# EAGLE design satshakit-mega (EAGLE 8.4.3)

## Sheet 1 of 2
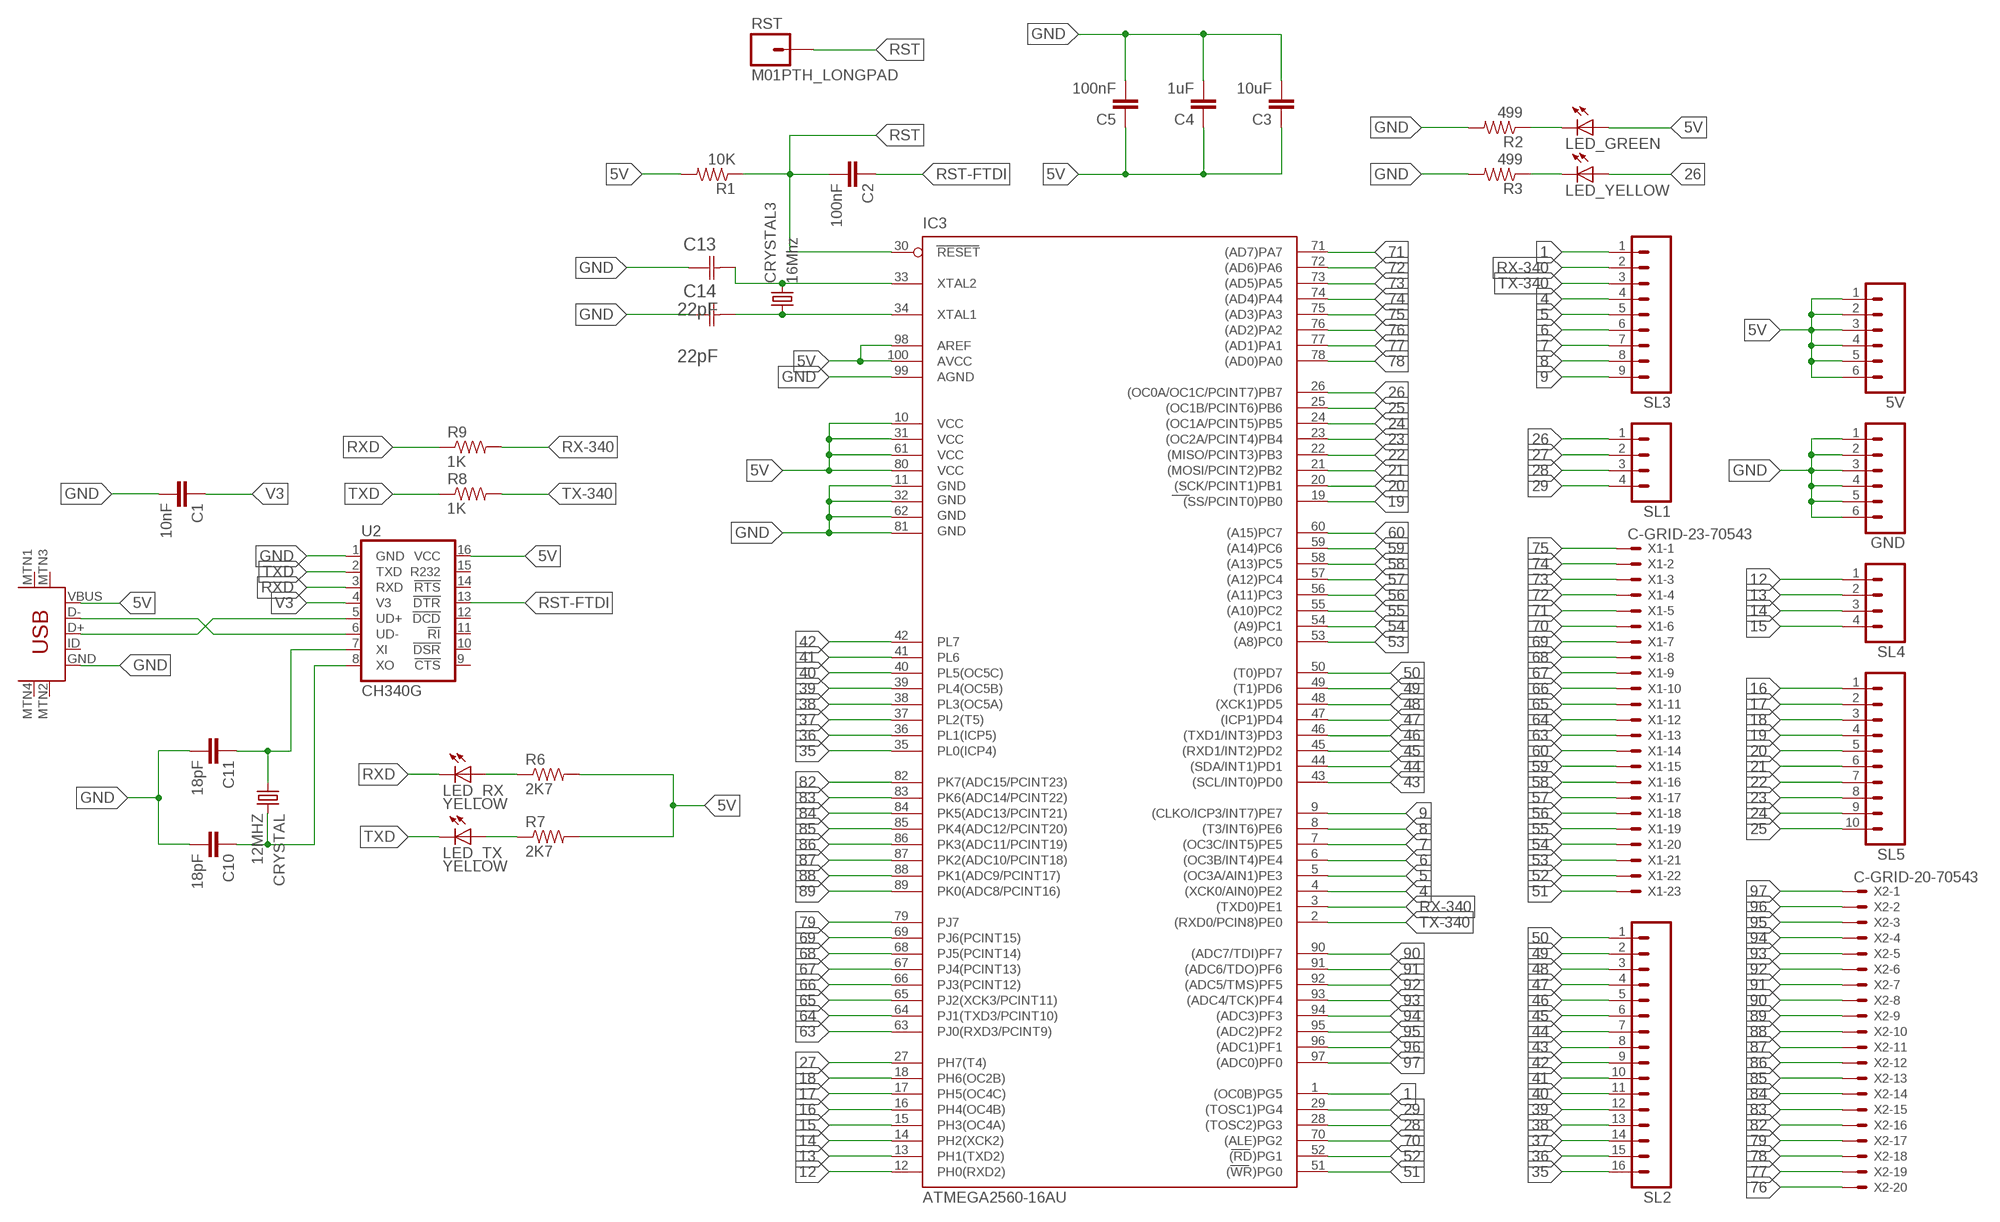
[diagram p0: schematic, sheet 1]

### Parts
5V  M06  [06P]
C1  10nF  CAP1206  [1206]
C2  100nF  CAP1206  [1206]
C3  10uF  CAP1206  [1206]
C4  1uF  CAP1206  [1206]
C5  100nF  CAP1206  [1206]
C10  18pF  CAP1206  [1206]
C11  18pF  CAP1206  [1206]
C13  22pF  0612ZC225MAT2A  [CAPC3216X178N]
C14  22pF  0612ZC225MAT2A  [CAPC3216X178N]
CRYSTAL  12MHZ  CSM-7X-DU  [CSM-7X-DU]
CRYSTAL3  16Mhz  CSM-7X-DU  [CSM-7X-DU]
GND  M06  [06P]
IC3  ATMEGA2560-16AU  ATMEGA1280-16AU  [TQFP100]
LED_GREEN  LED1206  [1206]
LED_RX  YELLOW  LED  [LED1206]
LED_TX  YELLOW  LED  [LED1206]
LED_YELLOW  LED1206  [1206]
R1  10K  RES-US1206  [R1206]
R2  499  RESISTOR1206  [1206]
R3  499  RESISTOR1206  [1206]
R6  2K7  RES-US1206  [R1206]
R7  2K7  RES-US1206  [R1206]
R8  1K  RES-US1206  [R1206]
R9  1K  RES-US1206  [R1206]
RST  M01PTH_LONGPAD  [1X01_LONGPAD]
SL1  M04  [04P]
SL2  M16  [16P]
SL3  M09  [09P]
SL4  M04  [04P]
SL5  M10  [10P]
U2  CH340G  CH340GSMD  [SO016]
U$7  USB-MINIB-5PIN  [USB-MINIB]
X1  C-GRID-23-70543  [70543-23]
X2  C-GRID-20-70543  [70543-20]

### Nets
1: IC3.1((OC0B)PG5) SL3.1
4: IC3.4((XCK0/AIN0)PE2) SL3.4
5: IC3.5((OC3A/AIN1)PE3) SL3.5
5V: 5V.1 5V.2 5V.3 5V.4 5V.5 5V.6 C3.1 C4.1 C5.1 IC3.10(VCC) IC3.31(VCC1) IC3.61(VCC2) IC3.80(VCC3) IC3.98(AREF) IC3.100(AVCC) LED_GREEN.1(A) R1.2 R6.2 R7.2 U2.16(VCC) U$7.VBUS
6: IC3.6((OC3B/INT4)PE4) SL3.6
7: IC3.7((OC3C/INT5)PE5) SL3.7
8: IC3.8((T3/INT6)PE6) SL3.8
9: IC3.9((CLKO/ICP3/INT7)PE7) SL3.9
12: IC3.12(PH0(RXD2)) SL4.1
13: IC3.13(PH1(TXD2)) SL4.2
14: IC3.14(PH2(XCK2)) SL4.3
15: IC3.15(PH3(OC4A)) SL4.4
16: IC3.16(PH4(OC4B)) SL5.1
17: IC3.17(PH5(OC4C)) SL5.2
18: IC3.18(PH6(OC2B)) SL5.3
19: IC3.19((SS/PCINT0)PB0) SL5.4
20: IC3.20((SCK/PCINT1)PB1) SL5.5
21: IC3.21((MOSI/PCINT2)PB2) SL5.6
22: IC3.22((MISO/PCINT3)PB3) SL5.7
23: IC3.23((OC2A/PCINT4)PB4) SL5.8
24: IC3.24((OC1A/PCINT5)PB5) SL5.9
25: IC3.25((OC1B/PCINT6)PB6) SL5.10
26: IC3.26((OC0A/OC1C/PCINT7)PB7) LED_YELLOW.1(A) SL1.1
27: IC3.27(PH7(T4)) SL1.2
28: IC3.28((TOSC2)PG3) SL1.3
29: IC3.29((TOSC1)PG4) SL1.4
35: IC3.35(PL0(ICP4)) SL2.16
36: IC3.36(PL1(ICP5)) SL2.15
37: IC3.37(PL2(T5)) SL2.14
38: IC3.38(PL3(OC5A)) SL2.13
39: IC3.39(PL4(OC5B)) SL2.12
40: IC3.40(PL5(OC5C)) SL2.11
41: IC3.41(PL6) SL2.10
42: IC3.42(PL7) SL2.9
43: IC3.43((SCL/INT0)PD0) SL2.8
44: IC3.44((SDA/INT1)PD1) SL2.7
45: IC3.45((RXD1/INT2)PD2) SL2.6
46: IC3.46((TXD1/INT3)PD3) SL2.5
47: IC3.47((ICP1)PD4) SL2.4
48: IC3.48((XCK1)PD5) SL2.3
49: IC3.49((T1)PD6) SL2.2
50: IC3.50((T0)PD7) SL2.1
51: IC3.51((WR)PG0) X1.23
52: IC3.52((RD)PG1) X1.22
53: IC3.53((A8)PC0) X1.21
54: IC3.54((A9)PC1) X1.20
55: IC3.55((A10)PC2) X1.19
56: IC3.56((A11)PC3) X1.18
57: IC3.57((A12)PC4) X1.17
58: IC3.58((A13)PC5) X1.16
59: IC3.59((A14)PC6) X1.15
60: IC3.60((A15)PC7) X1.14
63: IC3.63(PJ0(RXD3/PCINT9)) X1.13
64: IC3.64(PJ1(TXD3/PCINT10)) X1.12
65: IC3.65(PJ2(XCK3/PCINT11)) X1.11
66: IC3.66(PJ3(PCINT12)) X1.10
67: IC3.67(PJ4(PCINT13)) X1.9
68: IC3.68(PJ5(PCINT14)) X1.8
69: IC3.69(PJ6(PCINT15)) X1.7
70: IC3.70((ALE)PG2) X1.6
71: IC3.71((AD7)PA7) X1.5
72: IC3.72((AD6)PA6) X1.4
73: IC3.73((AD5)PA5) X1.3
74: IC3.74((AD4)PA4) X1.2
75: IC3.75((AD3)PA3) X1.1
76: IC3.76((AD2)PA2) X2.20
77: IC3.77((AD1)PA1) X2.19
78: IC3.78((AD0)PA0) X2.18
79: IC3.79(PJ7) X2.17
82: IC3.82(PK7(ADC15/PCINT23)) X2.16
83: IC3.83(PK6(ADC14/PCINT22)) X2.15
84: IC3.84(PK5(ADC13/PCINT21)) X2.14
85: IC3.85(PK4(ADC12/PCINT20)) X2.13
86: IC3.86(PK3(ADC11/PCINT19)) X2.12
87: IC3.87(PK2(ADC10/PCINT18)) X2.11
88: IC3.88(PK1(ADC9/PCINT17)) X2.10
89: IC3.89(PK0(ADC8/PCINT16)) X2.9
90: IC3.90((ADC7/TDI)PF7) X2.8
91: IC3.91((ADC6/TDO)PF6) X2.7
92: IC3.92((ADC5/TMS)PF5) X2.6
93: IC3.93((ADC4/TCK)PF4) X2.5
94: IC3.94((ADC3)PF3) X2.4
95: IC3.95((ADC2)PF2) X2.3
96: IC3.96((ADC1)PF1) X2.2
97: IC3.97((ADC0)PF0) X2.1
GND: C1.2 C3.2 C4.2 C5.2 C10.2 C11.2 C13.1(C1) C14.1(C1) GND.1 GND.2 GND.3 GND.4 GND.5 GND.6 IC3.11(GND) IC3.32(GND1) IC3.62(GND2) IC3.81(GND3) IC3.99(AGND) R2.2 R3.2 U2.1(GND) U$7.GND
N$1: U2.5(UD+) U$7.D+
N$2: LED_RX.1(A) R6.1
N$3: U2.6(UD-) U$7.D-
N$4: C14.2(C2) CRYSTAL3.1 IC3.34(XTAL1)
N$5: C13.2(C2) CRYSTAL3.2 IC3.33(XTAL2)
N$6: LED_YELLOW.2(C) R3.1
N$8: LED_TX.1(A) R7.1
N$26: LED_GREEN.2(C) R2.1
OSC_IN: C10.1 CRYSTAL.2 U2.8(XO)
OSC_OUT: C11.1 CRYSTAL.1 U2.7(XI)
RST: C2.2 IC3.30(RESET) R1.1 RST.1
RST-FTDI: C2.1 U2.13(!DTR)
RX-340: IC3.3((TXD0)PE1) R9.2 SL3.2
RXD: LED_RX.2(C) R9.1 U2.3(RXD)
TX-340: IC3.2((RXD0/PCIN8)PE0) R8.2 SL3.3
TXD: LED_TX.2(C) R8.1 U2.2(TXD)
V3: C1.1 U2.4(V3)
Unconnected: U2.9(!CTS) U2.10(!DSR) U2.11(!RI) U2.12(!DCD) U2.14(!RTS) U2.15(R232) U$7.ID U$7.MTN1(MTN2) U$7.MTN2(MTN3) U$7.MTN3(MTN1) U$7.MTN4

## Sheet 2 of 2

## Library data of the parts
5V GND = con-amp-quick:M06: AMP QUICK CONNECTOR; OC_FARNELL: unknown; OC_NEWARK: unknown
C1-C5 C10 C11 = 01_SparkFun:CAP: Capacitor Standard 0603 ceramic capacitor, and 0.1" leaded capacitor.
C13 C14 = AVX_By_element14_Batch_1:0612ZC225MAT2A: Capacitor 1206; MPN: 0612ZC225MAT2A; OC_FARNELL: -; OC_NEWARK: 12N3209; SUPPLIER: AVX; TOLERANCE: ±20%; VALUE: 2.2µF; VOLTAGERATING: 10V
CRYSTAL = flight_controller.lbr01_FAB_Hello:CSM-7X-DU: SMD CRYSTAL Source: www.ecsxtal.com .. Crystal 3.6864MHz CSM_7X_DU.PDF; OC_FARNELL: unknown; OC_NEWARK: unknown
CRYSTAL3 = 01_FAB_Hello:CSM-7X-DU: SMD CRYSTAL Source: www.ecsxtal.com .. Crystal 3.6864MHz CSM_7X_DU.PDF; OC_FARNELL: unknown; OC_NEWARK: unknown
IC3 = atmel-2005:ATMEGA*: MICROCONTROLLER 64/128/256 Kbytes FLASH 4 Kbytes EEPROM 8 Kbytes SRAM 86 General Purpose I/O pins 12-channels16-bit PWM 4 x Serial USARTs 16-channels 10-bit A/D
LED_GREEN LED_YELLOW = 01_FAB_Hello:LED
LED_RX LED_TX = fab:LED: LED
R1 R6-R9 = fab:RES-US: Resistor (US Symbol) Variants with postfix FAB are widened to allow the routing of internal traces
R2 R3 = 01_SparkFun:RESISTOR: Resistor Basic schematic elements and footprints for 0603, 1206, and PTH 1/10th watt (small) resistors.
RST = 01_SparkFun:M01: Header 1 Standard 1-pin 0.1" header. Use with straight break away headers (SKU : PRT-00116), right angle break away headers (PRT-00553), swiss pins (PRT-00743), machine pins (PRT-00117), and female headers (PRT-00115).
SL1 SL4 = con-amp-quick:M04: AMP QUICK CONNECTOR; OC_FARNELL: unknown; OC_NEWARK: unknown
SL2 = con-amp-quick:M16: AMP QUICK CONNECTOR; OC_FARNELL: unknown; OC_NEWARK: unknown
SL3 = con-amp-quick:M09: AMP QUICK CONNECTOR; OC_FARNELL: unknown; OC_NEWARK: unknown
SL5 = con-amp-quick:M10: AMP QUICK CONNECTOR; OC_FARNELL: unknown; OC_NEWARK: unknown
U2 = SparkFun-DigitalIC:CH340G: A simple USB 2.0 to Serial IC.; PROD_ID: IC-13498
U$7 = SparkFun:USB-MINIB
X1 = con-molex:C-GRID-23: CONNECTOR wire to board 2.54 mm (0.100") pitch header; OC_FARNELL: unknown; OC_NEWARK: unknown
X2 = con-molex:C-GRID-20: CONNECTOR wire to board 2.54 mm (0.100") pitch header; OC_FARNELL: unknown; OC_NEWARK: unknown

## Board
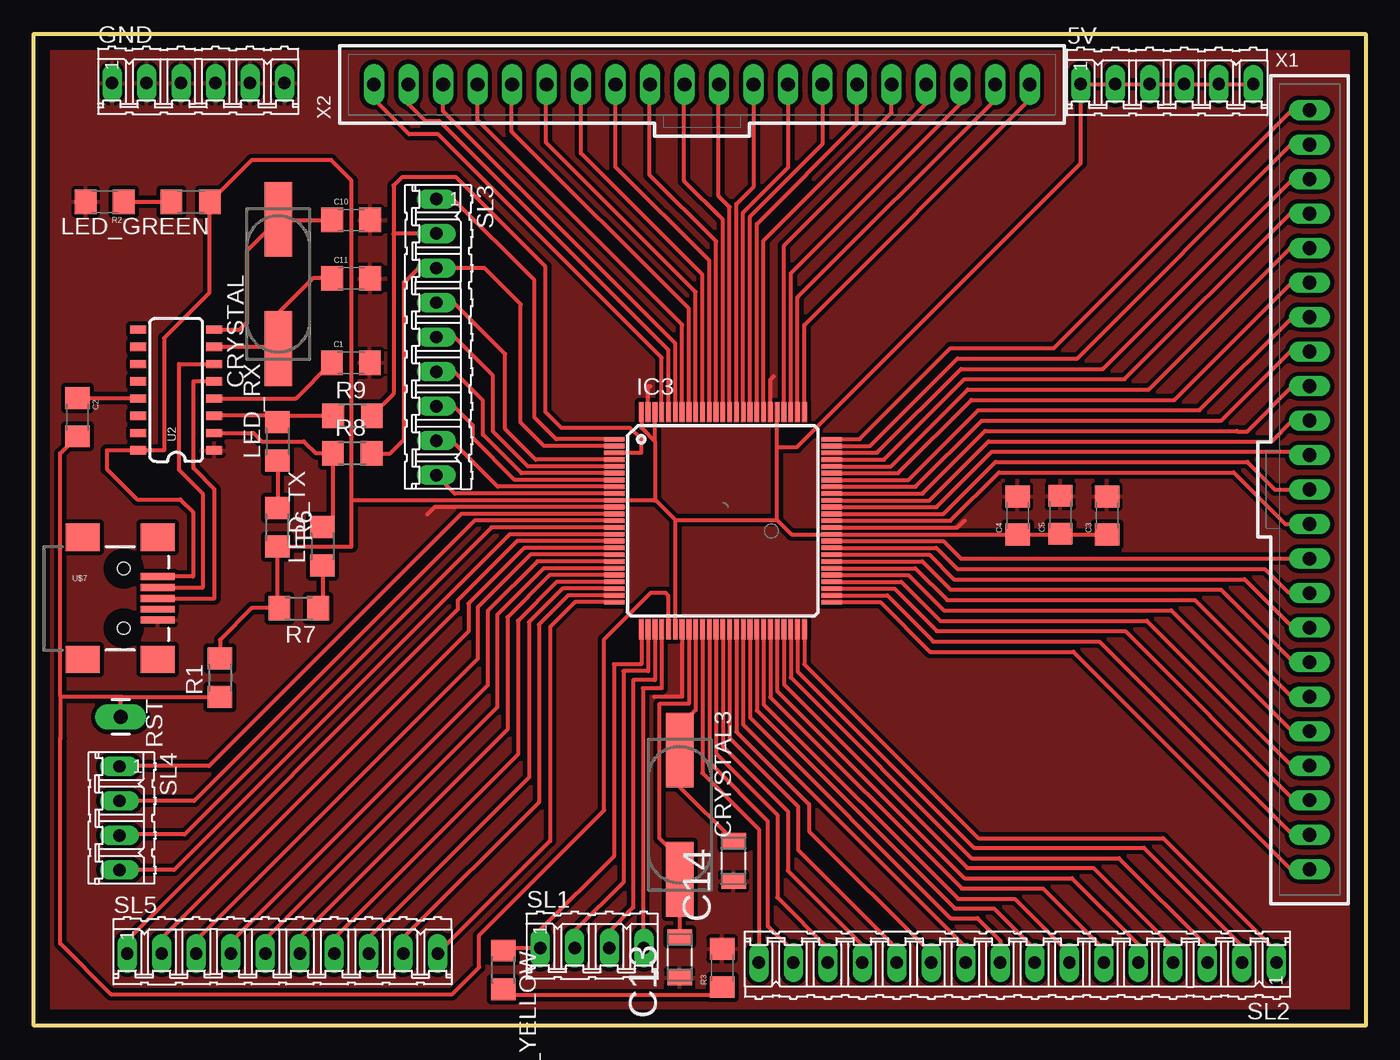
[diagram p1: board, top side]

Size 98 x 73 mm. Coordinates in mm from the lower left corner, seen from the top.
Outline: 0,0 0,73 98,73 98,0 0,0
Copper layers (1*16): Top 0.035mm / dielectric 1.5mm / Bottom 0.035mm
Design rules "default": minimum track width 10mil, minimum drill 24mil, track to track 8mil, track to pad 8mil, pad to pad 8mil, via to via 8mil, smd to smd 8mil, copper to edge 40mil, drill to drill 8mil, minimum pad ring 10mil, minimum via ring 8mil, stop-mask expansion 4mil, vias tented up to drill 0mil, thermal gap 10mil
tKeepout: 4 lines
bKeepout: 4 lines

### Footprints (pad centres in the part's own frame; a part is rotated, then mirrored left to right if it is on the bottom)
06P = drill 0.914 long: 1 -6.35,0; 2 -3.81,0; 3 -1.27,0; 4 1.27,0; 5 3.81,0; 6 6.35,0
1206 = smd 1.6 x 1.8: 1 -1.4,0; 2 1.4,0
CAPC3216X178N = smd 1.118 x 1.803: 1 -1.499,0; 2 1.499,0
CSM-7X-DU = smd 5.5 x 2: 1 -4.75,0; 2 4.75,0
TQFP100 = smd 1.5 x 0.35: 1 -8,6; 2 -8,5.5; 3 -8,5; 4 -8,4.5; 5 -8,4; 6 -8,3.5; 7 -8,3; 8 -8,2.5; 9 -8,2; 10 -8,1.5; 11 -8,1; 12 -8,0.5; 13 -8,0; 14 -8,-0.5; 15 -8,-1; 16 -8,-1.5; 17 -8,-2; 18 -8,-2.5; 19 -8,-3; 20 -8,-3.5; 21 -8,-4; 22 -8,-4.5; 23 -8,-5; 24 -8,-5.5; 25 -8,-6; 51 8,-6; 52 8,-5.5; 53 8,-5; 54 8,-4.5; 55 8,-4; 56 8,-3.5; 57 8,-3; 58 8,-2.5; 59 8,-2; 60 8,-1.5; 61 8,-1; 62 8,-0.5; 63 8,0; 64 8,0.5; 65 8,1; 66 8,1.5; 67 8,2; 68 8,2.5; 69 8,3; 70 8,3.5; 71 8,4; 72 8,4.5; 73 8,5; 74 8,5.5; 75 8,6 | smd 0.35 x 1.5: 26 -6,-8; 27 -5.5,-8; 28 -5,-8; 29 -4.5,-8; 30 -4,-8; 31 -3.5,-8; 32 -3,-8; 33 -2.5,-8; 34 -2,-8; 35 -1.5,-8; 36 -1,-8; 37 -0.5,-8; 38 0,-8; 39 0.5,-8; 40 1,-8; 41 1.5,-8; 42 2,-8; 43 2.5,-8; 44 3,-8; 45 3.5,-8; 46 4,-8; 47 4.5,-8; 48 5,-8; 49 5.5,-8; 50 6,-8; 76 6,8; 77 5.5,8; 78 5,8; 79 4.5,8; 80 4,8; 81 3.5,8; 82 3,8; 83 2.5,8; 84 2,8; 85 1.5,8; 86 1,8; 87 0.5,8; 88 0,8; 89 -0.5,8; 90 -1,8; 91 -1.5,8; 92 -2,8; 93 -2.5,8; 94 -3,8; 95 -3.5,8; 96 -4,8; 97 -4.5,8; 98 -5,8; 99 -5.5,8; 100 -6,8
1206' = smd 1.6 x 1.803: 1 -1.422,0; 2 1.422,0
LED1206 = smd 1.6 x 1.803: 1 -1.422,0; 2 1.422,0
R1206 = smd 1.6 x 1.803: 1 -1.422,0; 2 1.422,0
1X01_LONGPAD = drill 1.016 pad 1.88 long: 1 0,0
04P = drill 0.914 long: 1 -3.81,0; 2 -1.27,0; 3 1.27,0; 4 3.81,0
16P = drill 0.914 long: 1 -19.05,0; 2 -16.51,0; 3 -13.97,0; 4 -11.43,0; 5 -8.89,0; 6 -6.35,0; 7 -3.81,0; 8 -1.27,0; 9 1.27,0; 10 3.81,0; 11 6.35,0; 12 8.89,0; 13 11.43,0; 14 13.97,0; 15 16.51,0; 16 19.05,0
09P = drill 0.914 long: 1 -10.16,0; 2 -7.62,0; 3 -5.08,0; 4 -2.54,0; 5 0,0; 6 2.54,0; 7 5.08,0; 8 7.62,0; 9 10.16,0
10P = drill 0.914 long: 1 -11.43,0; 2 -8.89,0; 3 -6.35,0; 4 -3.81,0; 5 -1.27,0; 6 1.27,0; 7 3.81,0; 8 6.35,0; 9 8.89,0; 10 11.43,0
SO016 = smd 0.6 x 1.2: 1 -4.445,-2.8; 2 -3.175,-2.8; 3 -1.905,-2.8; 4 -0.635,-2.8; 5 0.635,-2.8; 6 1.905,-2.8; 7 3.175,-2.8; 8 4.445,-2.8; 9 4.445,2.8; 10 3.175,2.8; 11 1.905,2.8; 12 0.635,2.8; 13 -0.635,2.8; 14 -1.905,2.8; 15 -3.175,2.8; 16 -4.445,2.8
USB-MINIB = smd 2.5 x 0.5: D+ 2.5,0; D- 2.5,0.8; GND 2.5,-1.6; ID 2.5,-0.8; VBUS 2.5,1.6 | smd 2.5 x 2: MTN1 -3,4.5; MTN2 2.5,4.5; MTN3 -3,-4.5; MTN4 2.5,-4.5 | hole 0.9: 0,2.2; 0,-2.2
70543-23 = drill 1.016 long: 1 -27.94,0; 2 -25.4,0; 3 -22.86,0; 4 -20.32,0; 5 -17.78,0; 6 -15.24,0; 7 -12.7,0; 8 -10.16,0; 9 -7.62,0; 10 -5.08,0; 11 -2.54,0; 12 0,0; 13 2.54,0; 14 5.08,0; 15 7.62,0; 16 10.16,0; 17 12.7,0; 18 15.24,0; 19 17.78,0; 20 20.32,0; 21 22.86,0; 22 25.4,0; 23 27.94,0
70543-20 = drill 1.016 long: 1 -24.13,0; 2 -21.59,0; 3 -19.05,0; 4 -16.51,0; 5 -13.97,0; 6 -11.43,0; 7 -8.89,0; 8 -6.35,0; 9 -3.81,0; 10 -1.27,0; 11 1.27,0; 12 3.81,0; 13 6.35,0; 14 8.89,0; 15 11.43,0; 16 13.97,0; 17 16.51,0; 18 19.05,0; 19 21.59,0; 20 24.13,0

### Placement (x,y rotation side)
5V  83.39,69.31 0 top
C1  23.32,48.81 0 top
C2  3.2,44.79 270 top
C3  78.97,37.55 90 top
C4  72.39,37.55 90 top
C5  75.54,37.61 90 top
C10  23.34,59.3 0 top
C11  23.34,55 0 top
C13  47.52,5.04 90 top
C14  51.49,12.13 90 top
CRYSTAL  17.98,54.6 90 top
CRYSTAL3  47.52,15.53 270 top
GND  12.09,69.38 0 top
IC3  50.7,37.17 0 top
LED_GREEN  [1206']  11.53,60.64 180 top
LED_RX  17.93,43.02 90 top
LED_TX  21.24,35.29 90 top
LED_YELLOW  [1206']  34.55,4.1 270 top
R1  13.69,25.62 90 top
R2  5.21,60.64 180 top
R3  50.65,4.26 90 top
R6  17.93,36.69 270 top
R7  19.48,30.72 180 top
R8  23.42,42.13 0 top
R9  23.45,44.9 0 top
RST  6.38,22.72 270 top
SL1  41.07,5.73 0 top
SL2  72.39,4.66 180 top
SL3  29.62,50.69 270 top
SL4  6.3,15.28 270 top
SL5  18.29,5.32 0 top
U2  10.47,46.8 90 top
U$7  6.61,31.46 0 top
X1  93.88,39.46 270 top
X2  49.15,69.28 0 top

### Tracks (layer width: path | path; a pad name or v marks a point on that pad's centre or on a via)
1
  Top 0.305: IC3.1 38.43,43.17 36.83,44.77 36.83,54.88 30.86,60.85 SL3.1
4
  Top 0.305: IC3.4 36.93,41.67 34.67,43.93 34.67,49.44 30.89,53.23 SL3.4
5
  Top 0.305: IC3.5 36.36,41.17 33.78,43.75 33.78,47.84 30.94,50.69 SL3.5
5V
  Top 0.305: 54.7,37.24 54.7,42.61 | 54.7,42.61 IC3.80 | 54.7,37.24 55.76,36.17 IC3.61 72.37,36.17 C4.1 75.49,36.16 C5.1 75.59,36.16 C3.1 | IC3.31 47.2,37.24 | 47.2,37.24 54.7,37.24 | 45.62,38.67 IC3.10 | 45.62,38.67 45.76,38.67 47.2,37.24 | 45.7,43.02 IC3.98 | 45.7,43.02 45.7,38.75 45.62,38.67 | IC3.10 42.68,38.7 | 17.93,30.85 R6.2 23.37,35.27 23.37,38.67 | 17.93,30.85 R7.2 | 17.93,30.85 17.83,30.75 16.03,30.75 13.69,28.41 R1.2 | IC3.10 23.37,38.67 | U$7.VBUS 11.71,33.06 11.71,37.81 10.77,38.75 7.6,38.75 5.36,40.98 5.36,42.36 U2.16 9.58,42.36 9.58,50.61 12.88,53.91 12.88,60.57 LED_GREEN.1 | IC3.100 44.7,44.02 45.7,43.02 | LED_GREEN.1 16.03,63.72 21.87,63.72 23.37,62.22 23.37,38.67 | 12.96,60.11 LED_GREEN.1 | 54.7,42.61 56.16,42.61 77.04,63.49 5V.1 5V.2 5V.3 5V.4 5V.5 5V.6
6
  Top 0.305: IC3.6 35.87,40.67 33.05,43.5 33.05,46.01 30.89,48.17 29.64,48.17 SL3.6
7
  Top 0.305: IC3.7 35.38,40.17 32.31,43.24 32.31,44.18 30.91,45.58 29.64,45.58 SL3.7
8
  Top 0.305: IC3.8 34.13,39.67 30.81,42.99 29.69,42.99 SL3.8
9
  Top 0.305: IC3.9 30.97,39.17 SL3.9
12
  Top 0.305: IC3.12 31.44,37.67 12.88,19.11 6.33,19.11 SL4.1
13
  Top 0.305: IC3.13 32.41,37.17 11.79,16.55 SL4.2
14
  Top 0.305: IC3.14 33.66,36.67 11.08,14.09 6.38,14.09 SL4.3
15
  Top 0.305: IC3.15 35.02,36.17 10.31,11.47 SL4.4
16
  Top 0.305: IC3.16 35.56,35.67 31.19,31.31 31.19,30.65 6.88,6.34 6.88,5.35 SL5.1
17
  Top 0.305: IC3.17 36.08,35.17 31.98,31.08 31.98,29.02 9.4,6.44 SL5.2
18
  Top 0.305: IC3.18 36.54,34.67 32.67,30.8 32.67,27.01 11.96,6.31 11.96,5.35 SL5.3
19
  Top 0.305: IC3.19 37.06,34.17 33.4,30.52 33.4,25.06 14.48,6.13 SL5.4
20
  Top 0.305: IC3.20 37.52,33.67 34.09,30.24 34.09,23.43 17.05,6.39 17.05,5.35 SL5.5
21
  Top 0.305: IC3.21 37.96,33.17 34.85,30.06 34.85,21.81 19.56,6.52 SL5.6
22
  Top 0.305: IC3.22 38.48,32.67 35.61,29.81 35.61,19.98 22.07,6.44 22.07,5.35 SL5.7
23
  Top 0.305: IC3.23 38.89,32.17 36.42,29.71 36.42,18.28 24.66,6.52 24.66,5.35 SL5.8
24
  Top 0.305: IC3.24 39.31,31.67 37.16,29.53 37.16,16.45 27.2,6.49 27.2,5.35 SL5.9
25
  Top 0.305: IC3.25 39.82,31.17 38,29.35 38,13.6 SL5.10
26
  Top 0.305: IC3.26 44.7,26.61 42.67,26.61 42.67,12.48 37.26,7.08 SL1.1 34.75,5.73 LED_YELLOW.1
27
  Top 0.305: IC3.27 45.2,26.1 43.38,26.1 43.38,10.55 39.8,6.97 SL1.2
28
  Top 0.305: IC3.28 45.7,25.44 44.1,25.44 44.1,8.7 42.34,6.95 SL1.3
29
  Top 0.305: IC3.29 46.2,24.83 44.81,24.83 44.81,5.73 SL1.4
35
  Top 0.305: IC3.35 49.2,18.61 53.34,14.47 SL2.16
36
  Top 0.305: IC3.36 49.7,19.38 54,15.08 54,7.35 55.88,5.47 SL2.15
37
  Top 0.305: IC3.37 50.2,20.05 54.71,15.53 54.71,9.44 58.47,5.68 58.47,4.71 SL2.14
38
  Top 0.305: IC3.38 50.7,20.56 55.48,15.79 55.48,11.42 60.96,5.93 SL2.13
39
  Top 0.305: IC3.39 51.2,21.18 56.24,16.14 56.24,12.94 63.5,5.68 SL2.12
40
  Top 0.305: IC3.40 51.7,21.64 57.05,16.3 57.05,14.31 66.04,5.32 SL2.11
41
  Top 0.305: IC3.41 52.2,22.16 68.58,5.78 SL2.10
42
  Top 0.305: IC3.42 52.7,22.68 67.46,7.91 69.44,7.91 71.12,6.24 SL2.9
43
  Top 0.305: IC3.43 53.2,23.19 67.77,8.62 70.66,8.62 73.66,5.63 SL2.8
44
  Top 0.305: IC3.44 53.7,23.66 68.02,9.34 72.19,9.34 76.2,5.32 SL2.7
45
  Top 0.305: IC3.45 54.2,24.17 68.28,10.1 74.27,10.1 78.74,5.63 SL2.6
46
  Top 0.305: IC3.46 54.7,24.64 68.48,10.86 76.41,10.86 81.28,5.98 SL2.5
47
  Top 0.305: IC3.47 55.2,25.11 68.68,11.62 77.98,11.62 83.82,5.78 SL2.4
48
  Top 0.305: IC3.48 55.7,25.62 68.99,12.33 79.86,12.33 86.36,5.83 SL2.3
49
  Top 0.305: IC3.49 56.2,26.09 69.19,13.1 81.69,13.1 88.9,5.88 SL2.2
50
  Top 0.305: IC3.50 56.7,26.6 69.5,13.81 83.11,13.81 91.44,5.47 SL2.1
51
  Top 0.305: IC3.51 62.29,31.17 65.94,27.52 76.51,27.52 92.51,11.52 X1.23
52
  Top 0.305: IC3.52 62.8,31.67 66.19,28.28 78.41,28.28 92.61,14.09 93.86,14.09 X1.22
53
  Top 0.305: IC3.53 63.32,32.17 66.45,29.05 80.32,29.05 92.76,16.6 X1.21
54
  Top 0.305: IC3.54 63.84,32.67 66.7,29.81 81.92,29.81 92.58,19.14 X1.20
55
  Top 0.305: IC3.55 64.35,33.17 66.96,30.57 83.69,30.57 92.53,21.73 93.83,21.73 X1.19
56
  Top 0.305: IC3.56 64.87,33.67 67.21,31.33 85.45,31.33 92.58,24.2 93.86,24.2 X1.18
57
  Top 0.305: IC3.57 65.38,34.17 67.46,32.09 87.35,32.09 92.69,26.76 X1.17
58
  Top 0.305: IC3.58 65.9,34.67 67.72,32.86 89.11,32.86 92.64,29.32 93.86,29.32 X1.16
59
  Top 0.305: IC3.59 66.42,35.17 67.97,33.62 90.6,33.62 92.33,31.89 93.83,31.89 X1.15
60
  Top 0.305: IC3.60 66.93,35.67 68.23,34.38 X1.14
63
  Top 0.305: IC3.63 67.46,37.17 71.02,40.73 88.29,40.73 92.1,36.92 X1.13
64
  Top 0.305: IC3.64 66.95,37.67 70.77,41.49 89.31,41.49 91.34,39.46 X1.12
65
  Top 0.305: IC3.65 66.43,38.17 70.51,42.25 93.63,42.25 X1.11
66
  Top 0.305: IC3.66 65.92,38.67 70.26,43.02 91.09,43.02 92.61,44.54 X1.10
67
  Top 0.305: IC3.67 65.4,39.17 70,43.78 88.55,43.78 88.57,43.75 89.28,43.75 92.61,47.08 X1.9
68
  Top 0.305: IC3.68 64.88,39.67 69.75,44.54 87.38,44.54 92.48,49.65 93.86,49.65 X1.8
69
  Top 0.305: IC3.69 64.37,40.17 69.5,45.3 85.78,45.3 92.64,52.16 X1.7
70
  Top 0.305: IC3.70 63.6,40.67 68.99,46.06 83.92,46.06 92.56,54.7 X1.6
71
  Top 0.305: IC3.71 63.08,41.17 68.73,46.83 82.04,46.83 92.46,57.24 X1.5
72
  Top 0.305: IC3.72 62.57,41.67 68.48,47.59 80.27,47.59 92.43,59.76 93.86,59.76 X1.4
73
  Top 0.305: IC3.73 62.05,42.17 68.23,48.35 78.67,48.35 92.64,62.32 X1.3
74
  Top 0.305: IC3.74 61.53,42.67 67.97,49.11 76.79,49.11 92.51,64.83 93.86,64.83 X1.2
75
  Top 0.305: IC3.75 60.76,43.17 67.46,49.87 75.06,49.87 92.56,67.38 93.86,67.38 X1.1
76
  Top 0.305: IC3.76 56.7,51.58 73.31,68.19 73.31,69.25 X2.20
77
  Top 0.305: IC3.77 56.2,53.62 70.74,68.16 X2.19
78
  Top 0.305: IC3.78 55.7,55.38 68.23,67.91 68.23,69.25 X2.18
79
  Top 0.305: IC3.79 55.2,57.42 65.66,67.88 X2.17
82
  Top 0.305: IC3.82 53.7,57.8 63.12,67.22 X2.16
83
  Top 0.305: IC3.83 53.2,59 60.58,66.38 X2.15
84
  Top 0.305: IC3.84 52.7,59.57 58.07,64.94 58.07,69.25 X2.14
85
  Top 0.305: IC3.85 52.2,59.86 55.53,63.18 55.53,69.25 X2.13
86
  Top 0.305: IC3.86 51.7,60.48 52.99,61.76 52.99,69.25 X2.12
87
  Top 0.305: IC3.87 51.2,60.27 50.4,61.08 50.4,69.25 X2.11
88
  Top 0.305: IC3.88 50.7,59.32 47.85,62.17 47.85,69.25 X2.10
89
  Top 0.305: IC3.89 50.2,57.74 45.31,62.62 45.31,69.25 X2.9
90
  Top 0.305: IC3.90 49.7,56.31 42.8,63.21 X2.8
91
  Top 0.305: IC3.91 49.2,55.29 40.26,64.22 X2.7
92
  Top 0.305: IC3.92 48.7,54.01 37.7,65.01 37.7,69.25 X2.6
93
  Top 0.305: IC3.93 48.2,52.78 35.16,65.83 35.16,69.25 X2.5
94
  Top 0.305: IC3.94 47.7,51.6 32.67,66.64 32.67,69.25 X2.4
95
  Top 0.305: IC3.95 47.2,50.22 30.1,67.32 X2.3
96
  Top 0.305: IC3.96 46.7,49.73 29.85,66.59 28.8,66.59 27.56,67.83 | 27.56,67.83 27.56,67.81 | X2.2 27.56,68.31 27.56,67.83
97
  Top 0.305: IC3.97 46.2,49.17 29.75,65.62 27.61,65.62 25.02,68.21 | 25.02,68.21 25.02,68.19 | X2.1 25.02,68.85 25.02,68.21
GND
  Top 0.305: IC3.99 45.2,47.08 45.37,47.08 | 68.48,37.17 67.98,36.67 IC3.62 | 45.67,24.22 47.7,24.22 IC3.32 | 28.96,37.66 29.48,38.17 IC3.11 | IC3.81 54.2,47.56 54.46,47.82
  pour Top (isolate 0.305): 0.66,72.48 0.66,1.36 97.69,1.36 97.69,72.48
N$1
  Top 0.305: U$7.D+ 13.29,31.46 13.29,39.48 11.74,41.03 11.74,47.44 U2.5
N$2
  Top 0.305: LED_RX.1 R6.1
N$3
  Top 0.305: U$7.D- 12.45,32.26 12.45,39.13 10.67,40.91 10.67,48.71 U2.6
N$4
  Top 0.305: IC3.34 48.7,23.24 47.55,22.09 47.55,20.31 CRYSTAL3.1 47.52,17.59 C14.2
N$5
  Top 0.305: IC3.33 48.2,23.71 46.08,23.71 46.03,23.66 46.03,13.81 47.52,12.31 CRYSTAL3.2 | 47.5,12.38 47.5,10.81 CRYSTAL3.2 | CRYSTAL3.2 C13.2
N$6
  Top 0.305: 34.93,2.3 LED_YELLOW.2 34.98,2.25 50.06,2.25 50.06,2.27 R3.1
N$8
  Top 0.305: LED_TX.1 21.24,31.05 R7.1
N$26
  Top 0.305: R2.1 LED_GREEN.2
OSC_IN
  Top 0.305: U2.8 15.14,51.25 15.67,51.78 15.67,57.04 CRYSTAL.2 17.98,59.3 C10.1
OSC_OUT
  Top 0.305: U2.7 17.98,49.98 CRYSTAL.1 17.98,52.44 20.6,55.06 21.89,55.06 C11.1
RST
  Top 0.305: IC3.30 46.7,31.65 46.51,31.84 45.37,31.84 41.96,28.44 41.96,15.86 32.77,6.67 32.77,4.31 30.79,2.33 5.67,2.33 1.93,6.06 1.93,21.12 | 1.96,21.15 1.93,21.12 | 1.93,24.3 1.93,21.12 | 1.93,24.3 1.93,42.12 C2.2 | 6.48,24.2 R1.1 | 6.48,24.2 2.03,24.2 1.93,24.3 | RST.1 6.38,24.09 6.48,24.2
RST-FTDI
  Top 0.305: C2.1 7.64,46.19 U2.13
RX-340
  Top 0.305: R9.2 26.47,46.5 26.47,58.28 | 29.59,58.33 SL3.2 26.49,58.31 26.47,58.28 | 26.47,58.28 26.47,61.84 27.08,62.45 31.07,62.45 37.64,55.87 37.64,45.17 38.81,44.01 43.87,44.01 44.71,43.17 44.71,42.17 IC3.3
RXD
  Top 0.305: 18.57,44.9 U2.3 | 18.57,44.9 R9.1 | LED_RX.2 18.52,44.84 18.57,44.9
TX-340
  Top 0.305: R8.2 26.21,42.13 27.23,43.14 27.23,54.7 28.3,55.77 SL3.3 29.67,55.82 30.3,55.82 30.36,55.77 33.15,55.77 35.82,53.1 35.82,44.39 37.53,42.67 IC3.2
TXD
  Top 0.305: 21.29,42.15 21.97,42.15 R8.1 | R8.1 20.75,42.13 19.86,43.02 16.77,43.02 16.16,43.63 U2.2 | R8.1 22,37.48 LED_TX.2
V3
  Top 0.305: U2.4 19.28,46.17 C1.1